# EAGLE design bbf-audio_out (EAGLE 5.09)
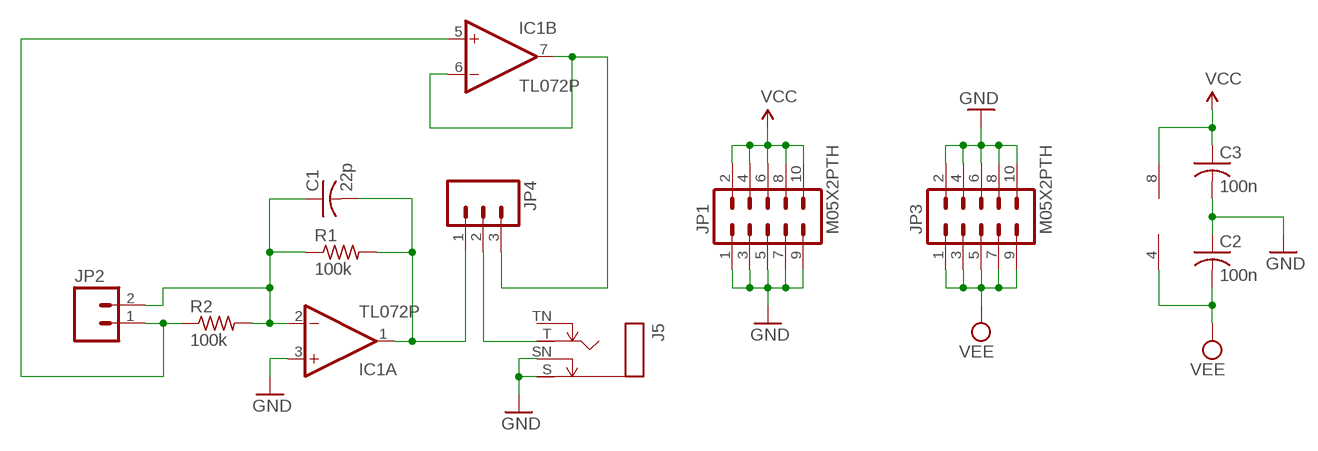
[diagram p0: schematic, sheet 1]

## Parts
C1  22p  C-US025-025X050  [C025-025X050]
C2  100n  C-US025-025X050  [C025-025X050]
C3  100n  C-US025-025X050  [C025-025X050]
IC1  TL072P  [DIL08]
J5  MONOSWSLIM  [NRJ4HF]
JP1  M05X2PTH  [AVR_ICSP]
JP2  M02PTH  [1X02]
JP3  M05X2PTH  [AVR_ICSP]
JP4  M03PTH  [1X03]
R1  100k  R-US_0204/7  [0204/7]
R2  100k  R-US_0204/7  [0204/7]

## Nets
GND: C2.1 C3.2 IC1.3(A:+IN) J5.S J5.SN JP1.1 JP1.3 JP1.5 JP1.7 JP1.9 JP3.2 JP3.4 JP3.6 JP3.8 JP3.10
N$1: C1.1 IC1.2(A:-IN) JP2.2 R1.1 R2.2
N$2: C1.2 IC1.1(A:OUT) JP4.1 R1.2
N$3: J5.T JP4.2
N$4: IC1.5(B:+IN) JP2.1 R2.1
N$5: IC1.6(B:-IN) IC1.7(B:OUT) JP4.3
VCC: C3.1 IC1.8(P:V+) JP1.2 JP1.4 JP1.6 JP1.8 JP1.10
VEE: C2.2 IC1.4(P:V-) JP3.1 JP3.3 JP3.5 JP3.7 JP3.9
Unconnected: J5.TN

## Library data of the parts
C1-C3 = rcl:C-US: CAPACITOR, American symbol
IC1 = linear:TL072: OP AMP
J5 = og-neutrik:MONOSW
JP1 JP3 = SparkFun:M05X2: Header 5x2 Standard 10-pin dual row 0.1" header. Commonly used with AVR-ISP. Use with Spark Fun Electronics SKU: PRT-00778
JP2 = SparkFun:M02: Header 2 Standard 2-pin 0.1" header. Use with straight break away headers (SKU : PRT-00116), right angle break away headers (PRT-00553), swiss pins (PRT-00743), machine pins (PRT-00117), and female headers (PRT-00115). Molex polarized connector foot print use with SKU : PRT-08233 with associated crimp pins and housings.
JP4 = SparkFun:M03: Header 3 Standard 3-pin 0.1" header. Use with straight break away headers (SKU : PRT-00116), right angle break away headers (PRT-00553), swiss pins (PRT-00743), machine pins (PRT-00117), and female headers (PRT-00115). Molex polarized connector foot print use with SKU : PRT-08232 with associated crimp pins and housings.
R1 R2 = rcl:R-US_: RESISTOR, American symbol

## Board
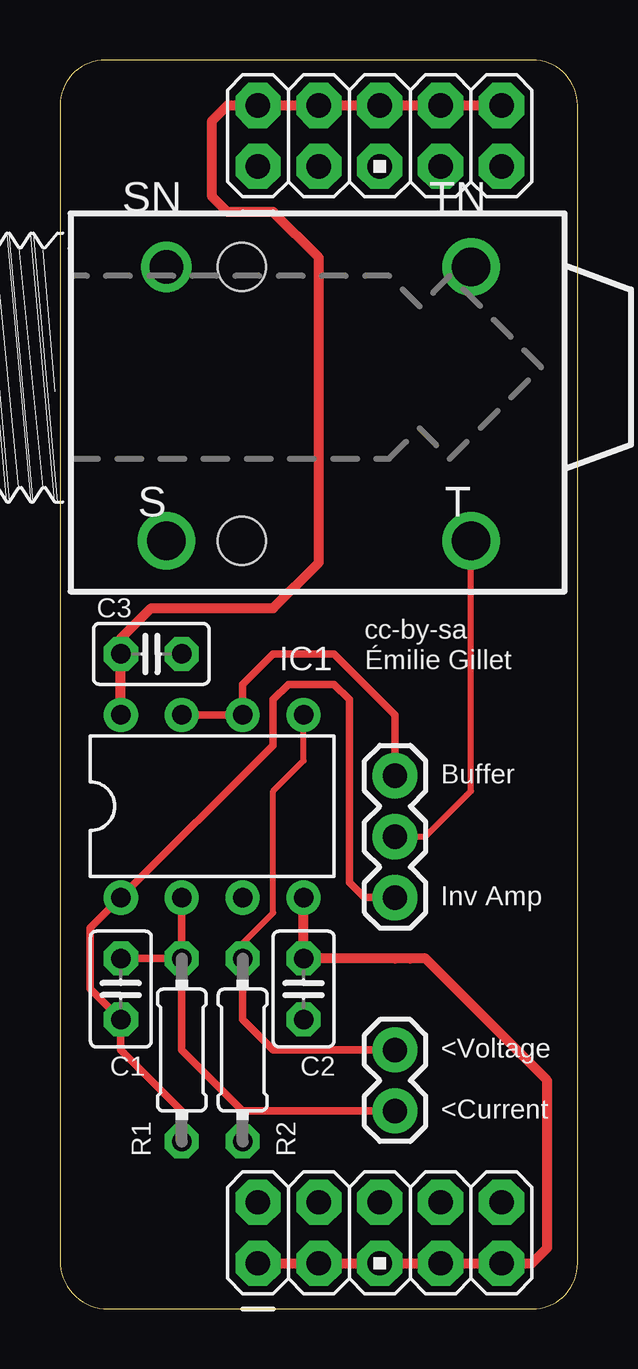
[diagram p1: board, top side]
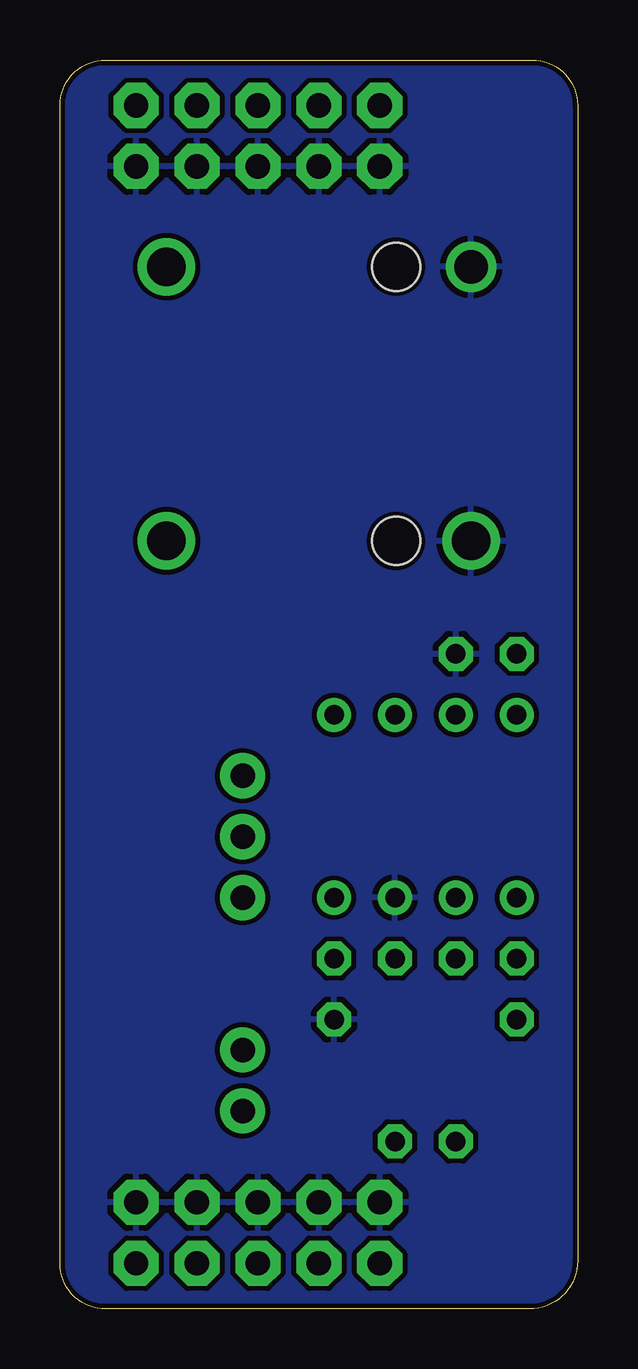
[diagram p2: board, bottom side, seen from below]

Size 21.59 x 52.06 mm. Coordinates in mm from the lower left corner, seen from the top.
Outline: 19.68,0 arc90 21.59,1.91 21.59,50.16 arc90 19.7,52.06 1.89,52.06 arc90 0,50.16 0,2.01 arc90 2.01,0 19.68,0
Copper layers (1*16): Top 0.035mm / dielectric 1.5mm / Bottom 0.035mm
Design rules "SparkFun_10mil *": minimum track width 8mil, minimum drill 20mil, track to track 8mil, track to pad 8mil, pad to pad 8mil, via to via 8mil, smd to smd 8mil, copper to edge 8mil, drill to drill 8mil, minimum pad ring 12mil, minimum via ring 10mil, stop-mask expansion 4mil, vias tented up to drill 25mil, thermal gap 10mil

### Footprints (pad centres in the part's own frame; a part is rotated, then mirrored left to right if it is on the bottom)
C025-025X050 = drill 0.813 octagon: 1 -1.27,0; 2 1.27,0
DIL08 = drill 0.813 pad 1.27 round: 1 -3.81,-3.81; 2 -1.27,-3.81; 3 1.27,-3.81; 4 3.81,-3.81; 5 3.81,3.81; 6 1.27,3.81; 7 -1.27,3.81; 8 -3.81,3.81
NRJ4HF = drill 1.6 round: S 5.08,7.992; T -7.62,7.992; TN -7.62,-3.438 | drill 1.4 round: SN 5.08,-3.438 | hole 2: 1.948,7.992; 1.948,-3.438
AVR_ICSP = drill 1.016 pad 1.88 octagon: 1 -1.27,5.08; 2 1.27,5.08; 3 -1.27,2.54; 4 1.27,2.54; 5 -1.27,0; 6 1.27,0; 7 -1.27,-2.54; 8 1.27,-2.54; 9 -1.27,-5.08; 10 1.27,-5.08
1X02 = drill 1.016 pad 1.88 round: 1 0,0; 2 2.54,0
1X03 = drill 1.016 pad 1.88 round: 1 0,0; 2 2.54,0; 3 5.08,0
0204/7 = drill 0.813 octagon: 1 -3.81,0; 2 3.81,0

### Placement (x,y rotation side)
C1  2.54,13.34 270 top
C2  10.16,13.34 90 top
C3  3.81,27.3 0 top
IC1  6.35,20.96 0 top
J5  9.52,40.01 180 top
JP1  13.33,48.9 90 top
JP2  13.97,10.8 270 top
JP3  13.33,3.18 90 top
JP4  13.97,17.15 90 top
R1  5.08,10.8 270 top
R2  7.62,10.8 270 top

### Tracks (layer width: path | path; a pad name or v marks a point on that pad's centre or on a via)
GND
  pour Bottom: 19.68,0 arc90 21.59,1.91 21.59,50.16 arc90 19.68,52.07 1.9,52.07 arc90 0,50.16 0,1.91 arc90 1.9,0
N$1
  Top 0.305: R1.1 C1.1 | R1.1 IC1.2 | R1.1 5.08,10.8 7.62,8.26 | R2.2 7.62,8.26 | 7.62,8.26 JP2.2
N$2
  Top 0.305: R1.2 5.08,8.26 2.54,10.8 C1.2 1.27,13.34 1.27,15.88 IC1.1 8.89,23.5 8.89,25.4 9.52,26.04 11.43,26.04 12.06,25.4 12.06,17.78 12.7,17.15 JP4.1
N$3
  Top 0.254: JP4.2 15.24,19.69 17.14,21.59 J5.T
N$4
  Top 0.254: R2.1 7.62,15.24 8.89,16.51 8.89,21.59 10.16,22.86 IC1.5
  Top 0.305: R2.1 7.62,12.07 8.89,10.8 JP2.1
N$5
  Top 0.305: IC1.7 IC1.6 7.62,26.04 8.89,27.3 11.43,27.3 13.97,24.77 JP4.3
VCC
  Top 0.406: JP1.10 JP1.8 JP1.6 JP1.4 JP1.2 6.98,50.16 6.35,49.53 6.35,46.35 6.98,45.72 8.89,45.72 10.79,43.82 10.79,31.12 8.89,29.21 3.81,29.21 2.54,27.94 C3.1 IC1.8
VEE
  Top 0.406: JP3.1 JP3.3 JP3.5 JP3.7 JP3.9 19.68,1.91 20.32,2.54 20.32,9.52 15.24,14.61 14.6,14.61 13.97,14.61 C2.2 IC1.4

### Text on the board
tPlace: Buffer | Inv Amp | <Voltage | <Current
tNames: cc-by-sa | Émilie Gillet